# EAGLE design Segbot_schematic_v1 (EAGLE 7.0.0)
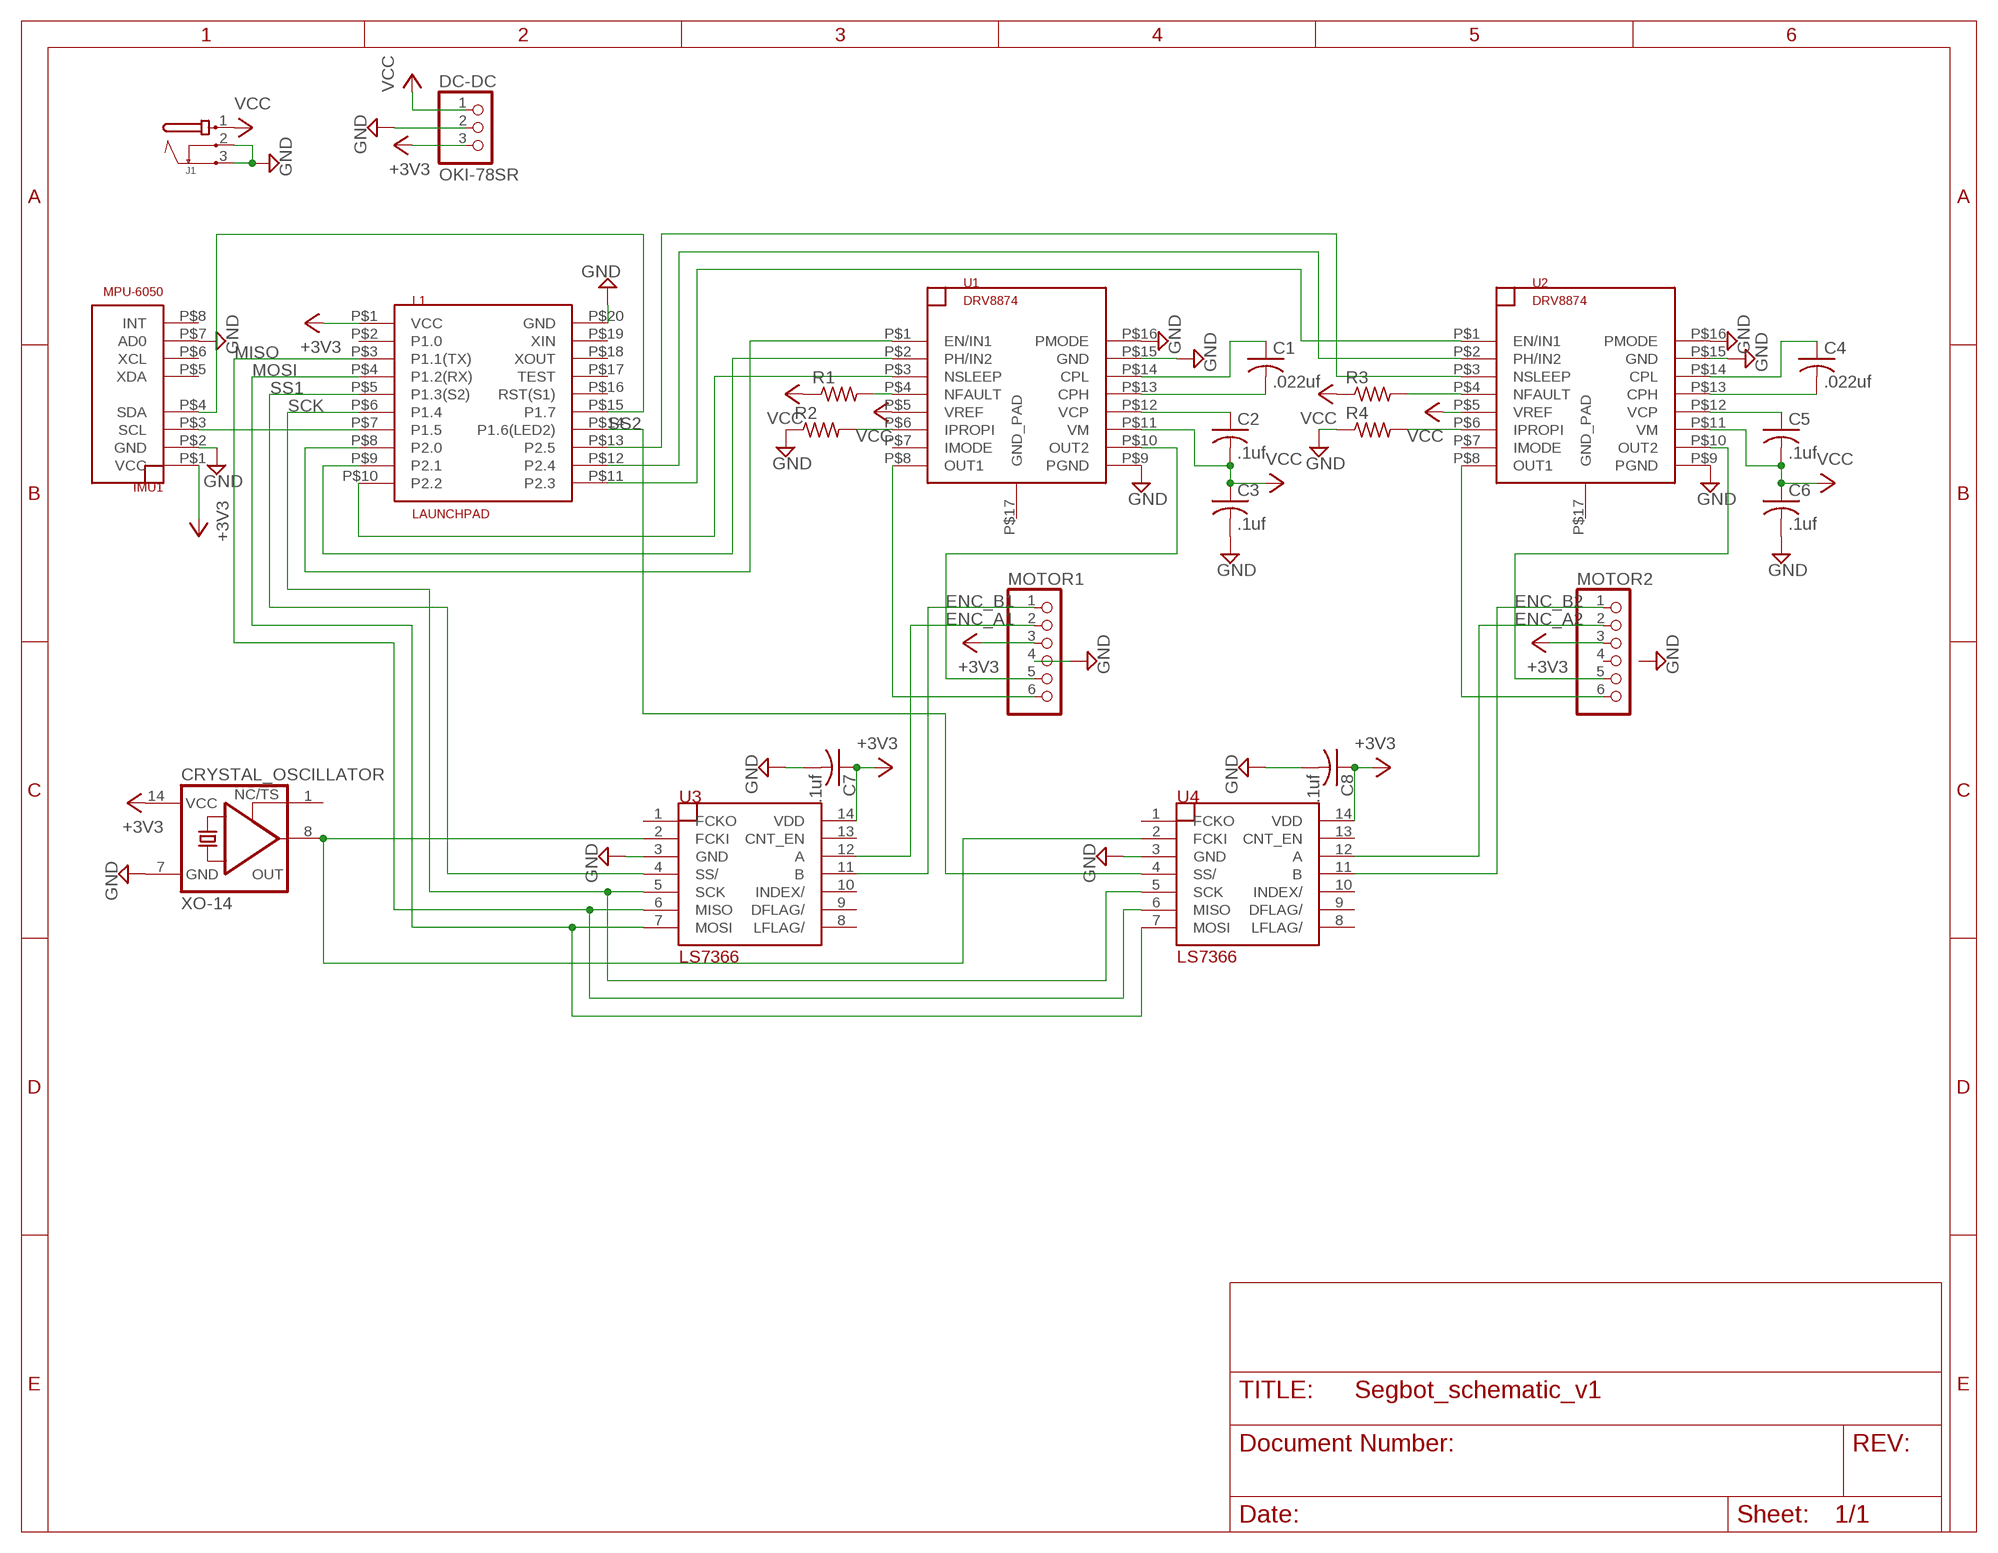
[diagram p0: schematic, sheet 1]

## Parts
C1  .022uf  C-US025-024X044  [C025-024X044]
C2  .1uf  C-US025-024X044  [C025-024X044]
C3  .1uf  C-US025-024X044  [C025-024X044]
C4  .022uf  C-US025-024X044  [C025-024X044]
C5  .1uf  C-US025-024X044  [C025-024X044]
C6  .1uf  C-US025-024X044  [C025-024X044]
C7  .1uf  C-USC1206  [C1206]
C8  .1uf  C-USC1206  [C1206]
CRYSTAL_OSCILLATOR  XO-14  [DIL14S]
DC-DC  OKI-78SR  PINHD-1X3  [1X03]
IMU1  MPU-6050  MPU6050_MODULE  [MPU6050_MODULE]
J1  JACK-PMS  [JACK-PMS]
L1  LAUNCHPAD  [LAUNCHPAD]
MOTOR1  PINHD-1X6  [1X06]
MOTOR2  PINHD-1X6  [1X06]
R1  R-US_R1206  [R1206]
R2  R-US_R1206  [R1206]
R3  R-US_R1206  [R1206]
R4  R-US_R1206  [R1206]
U1  DRV8874  [HTSSOP16]
U2  DRV8874  [HTSSOP16]
U3  LS7366  LS7366R  [SO14]
U4  LS7366  LS7366R  [SO14]

## Nets
+3V3 [supply]: C7.1 C8.1 CRYSTAL_OSCILLATOR.14(VCC) DC-DC.3 IMU1.P$1(VCC) L1.P$1(VCC) MOTOR1.3 MOTOR2.3 U3.14(VDD) U4.14(VDD)
ENC_A1: MOTOR1.2 U3.12(A)
ENC_A2: MOTOR2.2 U4.12(A)
ENC_B1: MOTOR1.1 U3.11(B)
ENC_B2: MOTOR2.1 U4.11(B)
GND [supply]: C3.2 C6.2 C7.2 C8.2 CRYSTAL_OSCILLATOR.7(GND) DC-DC.2 IMU1.P$2(GND) IMU1.P$7(AD0) J1.2 J1.3 L1.P$20(GND) MOTOR1.4 R2.1 R4.1 U1.P$9(PGND) U1.P$15(GND) U1.P$16(PMODE) U2.P$9(PGND) U2.P$15(GND) U2.P$16(PMODE) U3.3(GND) U4.3(GND)
MISO: L1.P$3(P1.1(TX)) U3.6(MISO) U4.6(MISO)
MOSI: L1.P$4(P1.2(RX)) U3.7(MOSI) U4.7(MOSI)
N$1: IMU1.P$3(SCL) L1.P$7(P1.5)
N$2: IMU1.P$4(SDA) L1.P$15(P1.7)
N$3: L1.P$8(P2.0) U1.P$1(EN/IN1)
N$4: L1.P$9(P2.1) U1.P$2(PH/IN2)
N$5: L1.P$10(P2.2) U1.P$3(NSLEEP)
N$6: R1.2 U1.P$4(NFAULT)
N$7: R2.2 U1.P$6(IPROPI)
N$8: C1.1 U1.P$14(CPL)
N$9: C1.2 U1.P$13(CPH)
N$10: C2.1 U1.P$12(VCP)
N$12: MOTOR1.6 U1.P$8(OUT1)
N$13: MOTOR1.5 U1.P$10(OUT2)
N$14: L1.P$11(P2.3) U2.P$1(EN/IN1)
N$15: L1.P$12(P2.4) U2.P$2(PH/IN2)
N$16: L1.P$13(P2.5) U2.P$3(NSLEEP)
N$17: C4.1 U2.P$14(CPL)
N$18: C4.2 U2.P$13(CPH)
N$19: C5.1 U2.P$12(VCP)
N$21: R3.2 U2.P$4(NFAULT)
N$22: R4.2 U2.P$6(IPROPI)
N$23: MOTOR2.6 U2.P$8(OUT1)
N$24: MOTOR2.5 U2.P$10(OUT2)
N$27: CRYSTAL_OSCILLATOR.8(OUT) U3.2(FCKI) U4.2(FCKI)
SCK: L1.P$6(P1.4) U3.5(SCK) U4.5(SCK)
SS1: L1.P$5(P1.3(S2)) U3.4(SS/)
SS2: L1.P$14(P1.6(LED2)) U4.4(SS/)
VCC [supply]: C2.2 C3.1 C5.2 C6.1 DC-DC.1 J1.1 R1.1 R3.1 U1.P$5(VREF) U1.P$11(VM) U2.P$5(VREF) U2.P$11(VM)
Unconnected: CRYSTAL_OSCILLATOR.1(TS) IMU1.P$5(XDA) IMU1.P$6(XCL) IMU1.P$8(INT) L1.P$2(P1.0) L1.P$16(RST(S1)) L1.P$17(TEST) L1.P$18(XOUT) L1.P$19(XIN) MOTOR2.4 U1.P$7(IMODE) U1.P$17(GND_PAD) U2.P$7(IMODE) U2.P$17(GND_PAD) U3.1(FCKO) U3.8(LFLAG/) U3.9(DFLAG/) U3.10(INDEX/) U3.13(CNT_EN) U4.1(FCKO) U4.8(LFLAG/) U4.9(DFLAG/) U4.10(INDEX/) U4.13(CNT_EN)

## Library data of the parts
C1-C6 = resistor:C-US: CAPACITOR, American symbol
C7 C8 = rcl:C-US: CAPACITOR, American symbol
CRYSTAL_OSCILLATOR = SE423EagleLibrary:XO-: CRYSTAL; OC_FARNELL: unknown; OC_NEWARK: unknown
DC-DC = pinhead:PINHD-1X3: PIN HEADER
IMU1 = SE423EagleLibrary:MPU6050_MODULE
J1 = Power-in:JACK-PMS
L1 = SE423EagleLibrary:LAUNCHPAD
MOTOR1 MOTOR2 = pinhead:PINHD-1X6: PIN HEADER
R1-R4 = rcl:R-US_: RESISTOR, American symbol
U1 U2 = SE423EagleLibrary:DRV8874
U3 U4 = SE423EagleLibrary:LS7366R

## Net classes
0 default: width 0.203 mm, drill 0.508 mm, clearance 0.203 mm
1 supply: width 0.508 mm, drill 0.508 mm, clearance 0.203 mm

## Board
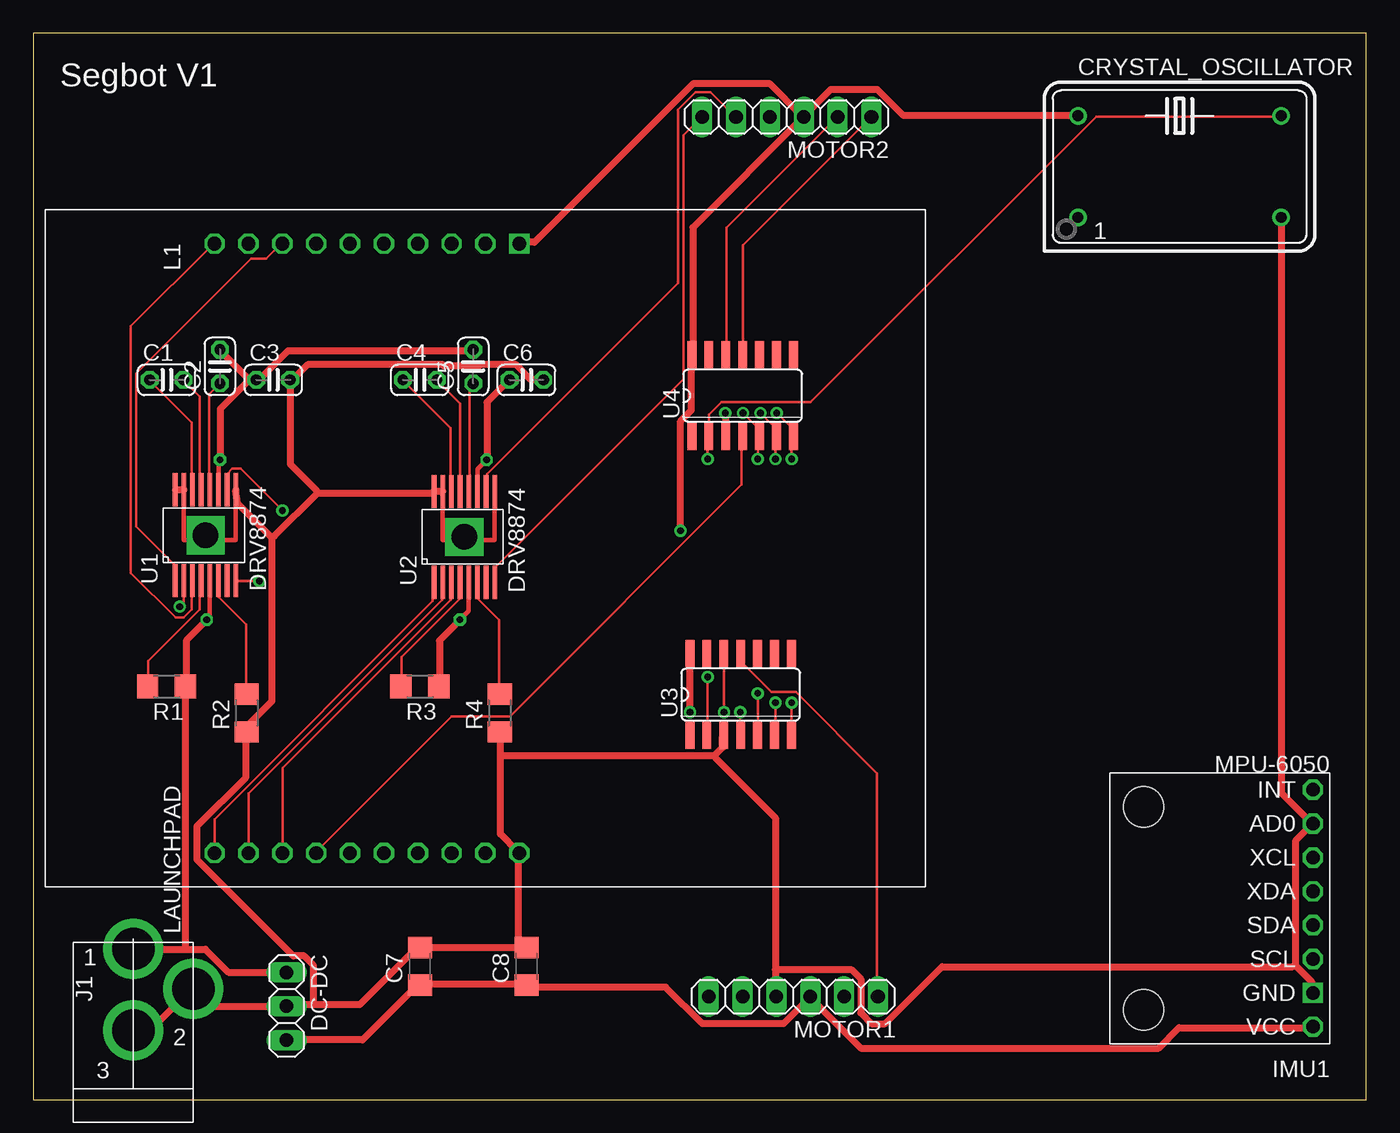
[diagram p1: board, top side]
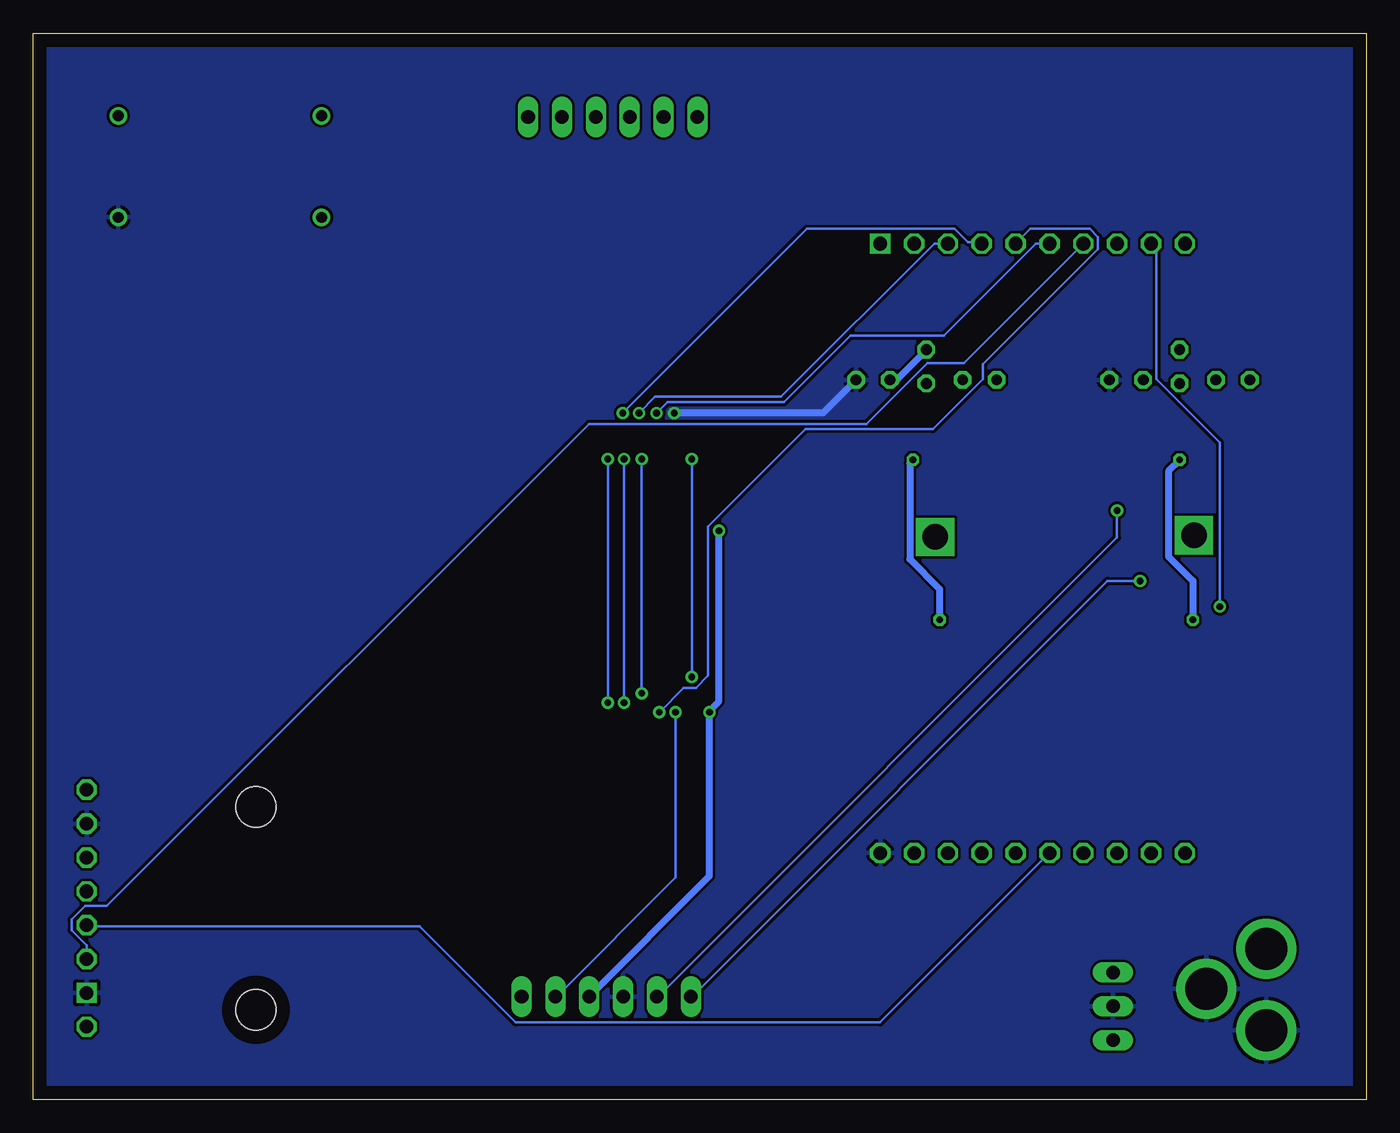
[diagram p2: board, bottom side, seen from below]

Size 100 x 80 mm. Coordinates in mm from the lower left corner, seen from the top.
Outline: 0,0 100,0 100,80 0,80 0,0
Copper layers (1*16): Top 0.035mm / dielectric 1.5mm / Bottom 0.035mm
Design rules "default *": minimum track width 8mil, minimum drill 20mil, track to track 8mil, track to pad 8mil, pad to pad 8mil, via to via 8mil, smd to smd 8mil, copper to edge 40mil, drill to drill 8mil, minimum pad ring 10mil, minimum via ring 8mil, stop-mask expansion 4mil, vias tented up to drill 20mil, thermal gap 10mil

### Footprints (pad centres in the part's own frame; a part is rotated, then mirrored left to right if it is on the bottom)
C025-024X044 = drill 0.813 octagon: 1 -1.27,0; 2 1.27,0
C1206 = smd 1.6 x 1.8: 1 -1.4,0; 2 1.4,0
DIL14S = drill 0.813: 1 -7.62,-3.81; 7 7.62,-3.81; 8 7.62,3.81; 14 -7.62,3.81
1X03 = drill 1.016 long: 1 -2.54,0; 2 0,0; 3 2.54,0
MPU6050_MODULE = drill 1.016 octagon: P$1 0,2.54; P$3 0,-2.54; P$4 0,-5.08; P$5 0,-7.62; P$6 0,-10.16; P$7 0,-12.7; P$8 0,-15.24 | drill 1.016 square: P$2 0,0 | hole 3.048: 12.7,-13.97; 12.7,1.27
JACK-PMS = drill 3.175 pad 4.5: 1 -0.5,-3.31; 2 -5,-0.31; 3 -0.5,2.809
LAUNCHPAD = drill 1.016 square: P$1 0,0 | drill 1.016 octagon: P$2 0,-2.54; P$3 0,-5.08; P$4 0,-7.62; P$5 0,-10.16; P$6 0,-12.7; P$7 0,-15.24; P$8 0,-17.78; P$9 0,-20.32; P$10 0,-22.86; P$11 45.72,-22.86; P$12 45.72,-20.32; P$13 45.72,-17.78; P$14 45.72,-15.24; P$15 45.72,-12.7; P$16 45.72,-10.16; P$17 45.72,-7.62; P$18 45.72,-5.08; P$19 45.72,-2.54; P$20 45.72,0
1X06 = drill 1.016 long: 1 -6.35,0; 2 -3.81,0; 3 -1.27,0; 4 1.27,0; 5 3.81,0; 6 6.35,0
R1206 = smd 1.6 x 1.803: 1 -1.422,0; 2 1.422,0
HTSSOP16 = smd 2.5 x 0.35: P$1 -3.4,2.275; P$2 -3.4,1.625; P$3 -3.4,0.975; P$4 -3.4,0.325; P$5 -3.4,-0.325; P$6 -3.4,-0.975; P$7 -3.4,-1.625; P$8 -3.4,-2.275; P$9 3.4,-2.275; P$10 3.4,-1.625; P$11 3.4,-0.975; P$12 3.4,-0.325; P$13 3.4,0.325; P$14 3.4,0.975; P$15 3.4,1.625; P$16 3.4,2.275 | drill 1.905 pad 2.54 square: P$17 0,0
SO14 = smd 0.66 x 2.032: 1 -3.81,-3.073; 2 -2.54,-3.073; 3 -1.27,-3.073; 4 0,-3.073; 5 1.27,-3.073; 6 2.54,-3.073; 7 3.81,-3.073; 8 3.81,3.073; 9 2.54,3.073; 10 1.27,3.073; 11 0,3.073; 12 -1.27,3.073; 13 -2.54,3.073; 14 -3.81,3.073

### Placement (x,y rotation side)
C1  10,54 0 top
C2  14,55 90 top
C3  18,54 0 top
C4  29,54 0 top
C5  33,55 90 top
C6  37,54 0 top
C7  29,10 90 top
C8  37,10 90 top
CRYSTAL_OSCILLATOR  86,70 0 top
DC-DC  19,7 270 top
IMU1  96,8 180 top
J1  7,8 180 top
L1  36.46,64.22 270 top
MOTOR1  57.02,7.72 180 top
MOTOR2  56.53,73.72 180 top
R1  10,31 180 top
R2  16,29 90 top
R3  29,31 180 top
R4  35,29 90 top
U1  12.92,42.34 90 top
U2  32.34,42.22 90 top
U3  53.07,30.39 0 top
U4  53.22,52.82 0 top

### Tracks (layer width: path | path; a pad name or v marks a point on that pad's centre or on a via)
+3V3  (via drill 0.51)
  Top 0.508: MOTOR2.3 57.71,73.66 49.48,65.43 49.48,55.98 U4.14 49.38,55.68 49.38,51.71 48.56,50.9 v48.56,42.67 | CRYSTAL_OSCILLATOR.14 78.33,73.86 65.23,73.86 63.3,75.79 59.84,75.79 57.91,73.86 MOTOR2.3 | L1.P$1 36.47,64.31 37.59,64.31 49.48,76.2 55.27,76.2 57.61,73.86 MOTOR2.3 | DC-DC.3 19.1,4.47 24.69,4.47 28.75,8.53 C7.1 29.06,8.64 36.98,8.64 C8.1 37.19,8.43 47.45,8.43 50.19,5.69 56.29,5.69 58.12,7.52 MOTOR1.3 58.32,7.62 62.08,3.86 84.43,3.86 85.95,5.38 95.91,5.38 IMU1.P$1 | v49.28,29.06 49.28,33.43 U3.14
  Bottom 0.508: MOTOR1.3 58.32,7.72 49.28,16.76 v49.28,29.06 49.17,29.26 48.56,29.87 v48.56,42.67
ENC_A1  (via drill 0.51)
  Top 0.203: v51.82,29.06 51.82,33.43 U3.12
  Bottom 0.203: v51.82,29.06 51.82,16.66 60.76,7.72 MOTOR1.2
ENC_A2
  Top 0.203: U4.12 52.02,55.98 52.02,65.43 60.25,73.66 MOTOR2.2
ENC_B1
  Top 0.203: U3.11 53.14,33.43 53.14,32.82 55.37,30.58 57.2,30.58 63.3,24.49 63.3,7.72 MOTOR1.1
ENC_B2
  Top 0.203: U4.11 53.24,55.98 53.24,64.11 62.79,73.66 MOTOR2.1
GND  (via drill 0.51)
  Top 0.35: U1.P$15 11.29,42 15.2,42 U1.P$9 | U2.P$15 30.71,42 34.62,42 U2.P$9
  Top 0.508: v51.92,51.51 51.92,49.78 U4.3 | U2.P$16 30.58,45.62 U2.P$15 | U2.P$16 | 17.88,42.16 17.88,29.87 16.05,28.04 16.05,27.64 R2.1 15.95,27.33 15.95,24.18 12.29,20.52 12.29,17.98 19.51,10.77 20.32,10.77 21.03,10.06 21.03,7.11 | 17.88,42.16 15.34,44.7 U1.P$9 | 21.34,45.52 29.87,45.52 U2.P$16 | 21.34,45.52 18.09,42.27 17.88,42.16 | U1.P$16 10.67,45.72 11.18,45.72 U1.P$15 | 21.34,45.52 21.23,45.72 19.3,47.65 19.3,53.95 C3.2 19.51,54.05 20.62,55.17 30.68,55.17 30.79,55.07 33.43,55.07 33.53,55.17 36.17,55.17 37.29,54.05 38.2,54.05 C6.2 | CRYSTAL_OSCILLATOR.7 93.67,66.14 93.67,22.96 95.91,20.73 IMU1.P$7 95.81,20.52 94.69,19.41 94.69,10.06 | 94.69,10.06 95.91,8.84 95.91,8.03 IMU1.P$2 | J1.3 7.52,5.28 8.84,5.28 11.79,8.23 J1.2 12.09,8.23 13.31,7.01 DC-DC.2 19.2,7.11 21.03,7.11 | 35.05,25.81 35.05,19.91 36.37,18.59 L1.P$20 36.37,18.29 36.37,11.58 C8.2 36.98,11.38 29.06,11.38 C7.2 28.75,11.38 24.49,7.11 21.03,7.11 | 35.05,25.81 35.05,27.53 R4.1 | 51.1,25.81 51.71,26.42 51.71,27.23 U3.3 | 35.05,25.81 51.1,25.81 | 55.68,9.75 55.68,21.13 51.21,25.6 51.1,25.81 | 55.68,9.75 55.68,7.72 MOTOR1.4 | 55.68,9.75 61.37,9.75 62.08,9.04 62.08,6.5 62.89,5.69 63.91,5.69 68.17,9.96 94.49,9.96 94.69,10.06
  Bottom 0.508: v51.92,51.51 40.74,51.51 38.3,53.95 C6.2
  pour Bottom: 0,0 0,80 100,80 100,0
MISO  (via drill 0.51)
  Top 0.203: v55.68,29.77 55.68,27.33 U3.6 | v55.68,48.06 55.68,49.68 U4.6 55.68,49.78 55.68,50.39 v54.56,51.51
  Bottom 0.203: v55.68,48.06 v55.68,29.77 | v54.56,51.51 53.34,52.73 43.89,52.73 32.41,64.21 31.39,64.21 L1.P$3
MOSI  (via drill 0.51)
  Top 0.203: v56.9,29.77 56.9,27.33 U3.7 | v56.9,48.06 56.9,49.58 57,49.68 U4.7 57,49.78 57,50.29 v55.78,51.51
  Bottom 0.203: v56.9,48.06 v56.9,29.77 | v55.78,51.51 41.96,65.33 30.89,65.33 29.87,64.31 28.85,64.31 L1.P$4
N$1
  Bottom 0.203: IMU1.P$3 96.01,10.57 96.01,11.58 97.13,12.7 97.13,13.51 96.11,14.53 94.49,14.53 58.32,50.7 37.49,50.7 32.92,55.27 30.18,55.27 21.23,64.21 L1.P$7
N$2
  Bottom 0.203: IMU1.P$4 95.91,13.01 71.02,13.01 63.8,5.79 36.47,5.79 23.77,18.49 L1.P$15
N$3
  Top 0.203: U1.P$1 10.57,39.01 10.57,40.13 7.72,42.98 7.72,54.46 16.36,63.09 17.48,63.09 18.59,64.21 L1.P$8
N$4  (via drill 0.51)
  Top 0.203: v10.97,36.98 11.28,37.29 11.28,38.91 U1.P$2
  Bottom 0.203: v10.97,36.98 10.97,49.28 15.75,54.05 15.75,63.91 16.05,64.21 L1.P$9
N$5
  Top 0.203: U1.P$3 11.89,38.91 11.89,36.78 11.28,36.17 10.67,36.17 7.32,39.52 7.32,58.01 13.51,64.21 L1.P$10
N$6
  Top 0.203: R1.2 8.64,31.09 8.64,32.92 12.5,36.78 12.5,38.91 U1.P$4
N$7
  Top 0.203: R2.2 15.95,30.48 15.95,35.66 13.92,37.69 13.92,38.91 U1.P$6
N$8
  Top 0.203: U1.P$14 11.89,45.82 11.89,50.8 8.74,53.95 C1.1
N$9
  Top 0.203: U1.P$13 12.5,45.82 12.5,52.73 11.28,53.95 C1.2
N$10
  Top 0.203: U1.P$12 13.21,45.82 13.21,52.93 13.92,53.65 C2.1
N$12  (via drill 0.51)
  Top 0.203: v16.97,38.91 15.24,38.91 U1.P$8
  Bottom 0.203: v16.97,38.91 19.41,38.91 50.6,7.72 MOTOR1.6
N$13  (via drill 0.51)
  Top 0.203: v18.69,44.2 15.54,47.35 14.94,47.35 14.53,46.94 14.53,45.82 U1.P$10
  Bottom 0.203: v18.69,44.2 18.69,42.16 53.14,7.72 MOTOR1.5
N$14
  Top 0.203: U2.P$1 29.97,38.81 29.97,37.39 13.61,21.03 13.61,18.59 L1.P$11
N$15
  Top 0.203: U2.P$2 30.68,38.81 30.68,37.49 16.15,22.96 16.15,18.59 L1.P$12
N$16
  Top 0.203: U2.P$3 31.29,38.81 31.29,37.49 18.69,24.89 18.69,18.59 L1.P$13
N$17
  Top 0.203: U2.P$14 31.29,45.72 31.29,50.39 27.74,53.95 C4.1
N$18
  Top 0.203: U2.P$13 32,45.72 32,52.22 30.28,53.95 C4.2
N$19
  Top 0.203: U2.P$12 32.72,45.72 32.72,53.44 32.92,53.65 C5.1
N$21
  Top 0.203: R3.2 27.64,31.09 27.64,33.22 32,37.59 32,38.81 U2.P$4
N$22
  Top 0.203: R4.2 34.95,30.48 34.95,35.97 33.33,37.59 U2.P$6
N$23
  Top 0.203: U2.P$8 34.65,38.91 34.65,39.93 48.77,54.05 48.77,72.34 50.09,73.66 MOTOR2.6
N$24
  Top 0.203: U2.P$10 34.04,45.72 34.04,46.94 48.36,61.27 48.36,74.27 49.68,75.59 50.8,75.59 52.63,73.76 MOTOR2.5
N$27  (via drill 0.51)
  Top 0.203: v50.6,31.7 50.6,27.33 U3.2 | v50.6,48.06 50.6,49.68 U4.2 50.7,49.78 50.7,51.41 51.61,52.32 58.32,52.32 79.76,73.76 93.57,73.76 CRYSTAL_OSCILLATOR.8
  Bottom 0.203: v50.6,48.06 v50.6,31.7
SCK  (via drill 0.51)
  Top 0.203: v54.36,30.48 54.36,27.33 U3.5 | v54.36,48.06 54.36,49.58 54.46,49.68 U4.5 54.46,49.78 54.46,50.29 v53.24,51.51
  Bottom 0.203: v54.36,48.06 v54.36,30.48 | v53.24,51.51 52.43,52.32 43.69,52.32 38.71,57.3 31.7,57.3 24.79,64.21 23.77,64.21 L1.P$6
SS1  (via drill 0.51)
  Top 0.203: v53.03,29.06 53.03,27.33 U3.4
  Bottom 0.203: v53.03,29.06 51.21,30.89 50.29,30.89 49.38,31.8 49.38,42.98 42.06,50.29 32.51,50.29 28.75,54.05 28.75,55.17 20.12,63.8 20.12,64.72 20.73,65.33 25.2,65.33 26.21,64.31 L1.P$5
SS2
  Top 0.203: U4.4 53.14,49.68 53.14,46.13 35.76,28.75 31.39,28.75 21.23,18.59 L1.P$14
VCC  (via drill 0.51)
  Top 0.35: U1.P$11 13.89,47.9 v14,48 | U2.P$11 33.31,47.31 v34,48 | U1.P$5 13.24,36.24 v13,36 | U2.P$5 32.66,36.66 v32,36
  Top 0.508: R3.1 30.48,31.09 30.48,34.44 31.9,35.87 v32,36 | v34,48 34.04,48.16 34.04,52.32 35.66,53.95 C6.1 | 11.38,11.28 7.52,11.28 J1.1 | 11.38,11.28 12.9,11.28 14.63,9.55 DC-DC.1 | v13,36 12.9,35.87 11.48,34.44 11.48,31.09 R1.1 11.38,30.79 11.38,11.28 | 16.15,54.05 16.66,54.05 C3.1 16.97,54.05 19.1,56.19 32.92,56.19 C5.2 | 16.15,54.05 14.02,56.19 C2.2 | v14,48 14.02,48.16 14.02,51.82 16.05,53.85 16.15,54.05
  Bottom 0.508: C6.1 35.66,54.05 35.15,54.05 33.02,56.19 C5.2 | v32,36 32,36.07 32,38.3 34.24,40.54 34.24,47.75 34.04,47.95 v34,48 | v13,36 13.01,36.07 13.01,38.91 14.83,40.74 14.83,47.14 14.02,47.95 v14,48

### Text on the board
tPlace: Segbot V1